# EAGLE design valve board-OSH (EAGLE 7.6.0)
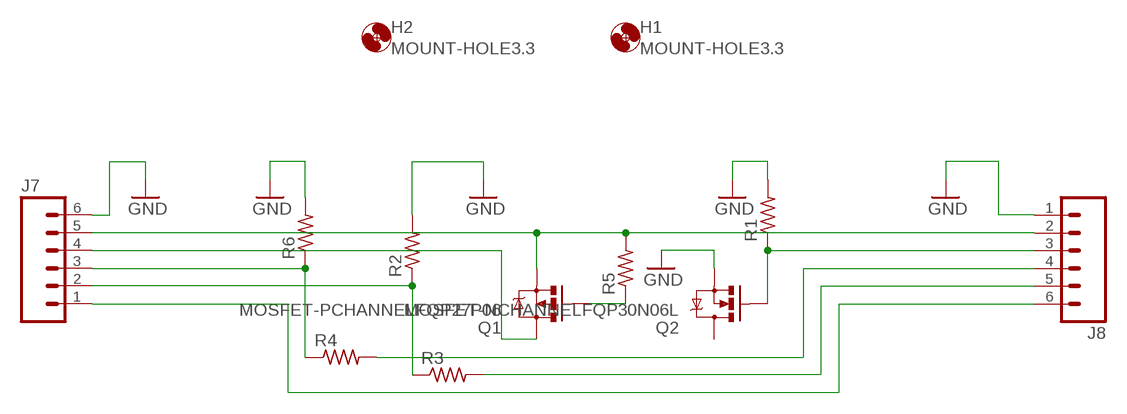
[diagram p0: schematic, sheet 1]

## Parts
H1  MOUNT-HOLE3.3  [3,3]
H2  MOUNT-HOLE3.3  [3,3]
J7  M06LOCK_LONGPADS  [1X06_LOCK_LONGPADS]
J8  M06LOCK_LONGPADS  [1X06_LOCK_LONGPADS]
Q1  MOSFET-PCHANNELFQP27P06  [TO220V]
Q2  MOSFET-NCHANNELFQP30N06L  [TO220V]
R1  R-US_0207/10  [0207/10]
R2  R-US_0207/10  [0207/10]
R3  R-US_0207/10  [0207/10]
R4  R-US_0207/10  [0207/10]
R5  R-US_0207/10  [0207/10]
R6  R-US_0207/10  [0207/10]

## Nets
GND: J7.6 J8.1 Q2.3(S) R1.2 R2.2 R6.2
N$1: J8.4 R4.2
N$2: J8.5 R3.2
N$3: J7.4 Q1.2(D)
N$4: J7.5 J8.2 Q1.3(S) R5.2
N$6: J7.2 R2.1 R3.1
N$7: Q1.1(G) R5.1
N$9: J8.3 Q2.1(G) R1.1
N$10: J7.3 R4.1 R6.1
N$12: J7.1 J8.6
Unconnected: Q2.2(D)

## Library data of the parts
H1 H2 = holes:MOUNT-HOLE: MOUNTING HOLE with drill center marker
J7 J8 = SparkFun-Connectors:M06: Header 6 Standard 6-pin 0.1" header. Use with straight break away headers (SKU : PRT-00116), right angle break away headers (PRT-00553), swiss pins (PRT-00743), machine pins (PRT-00117), and female headers (PRT-00115). Molex polarized connector foot print use with SKU : PRT-08094 with associated crimp pins and housings. NOTES ON THE VARIANTS LOCK and LOCK_LONGPADS... This footprint was designed to help hold the alignment of a through-hole component (i.e. 6-pin header) while soldering it into place. You may notice that each hole has been shifted either up or down by 0.005 of an inch from it's more standard position (which is a perfectly straight line). This slight alteration caused the pins (the squares in the middle) to touch the edges of the holes. Because they are alternating, it causes a "brace" to hold the component in place. 0.005 has proven to be the perfect amount of "off-center" position when using our standard breakaway headers. Although looks a little odd when you look at the bare footprint, once you have a header in there, the alteration is very hard to notice. Also,if you push a header all the way into place, it is covered up entirely on the bottom side. This idea of altering the position of holes to aid alignment will be further integrated into the Sparkfun Library for other footprints. It can help hold any component with 3 or more connection pins.
Q1 = SparkFun-DiscreteSemi:MOSFET-PCHANNEL: Generic PMOSFET IRLML2244 - TRANS-11153 (SOT-23 -20V -4.3A) (1.Gate 2.Source 3.Drain) FQP27P06 - COM-10349 <http://www.sparkfun.com/products/10349> (TO-220 -60V -27A) (1.Gate 2.Source 3.Drain)
Q2 = SparkFun-DiscreteSemi:MOSFET-NCHANNEL: Common NMOSFET Parts MFG P/N Store ID Prod ID FDD8780 TRANS-09984 SI7820DN TRANS-11055 FDS6630A IC-08089 2N7002PW TRANS-11151 FQP30N06L COM-10213 TRANS-10060 BSS123LT1G TRANS-08345 BSS138 TRANS-00830 BS170 2N7000; PROD_ID: TRANS-10060
R1-R6 = resistor:R-US_: RESISTOR, American symbol

## Board
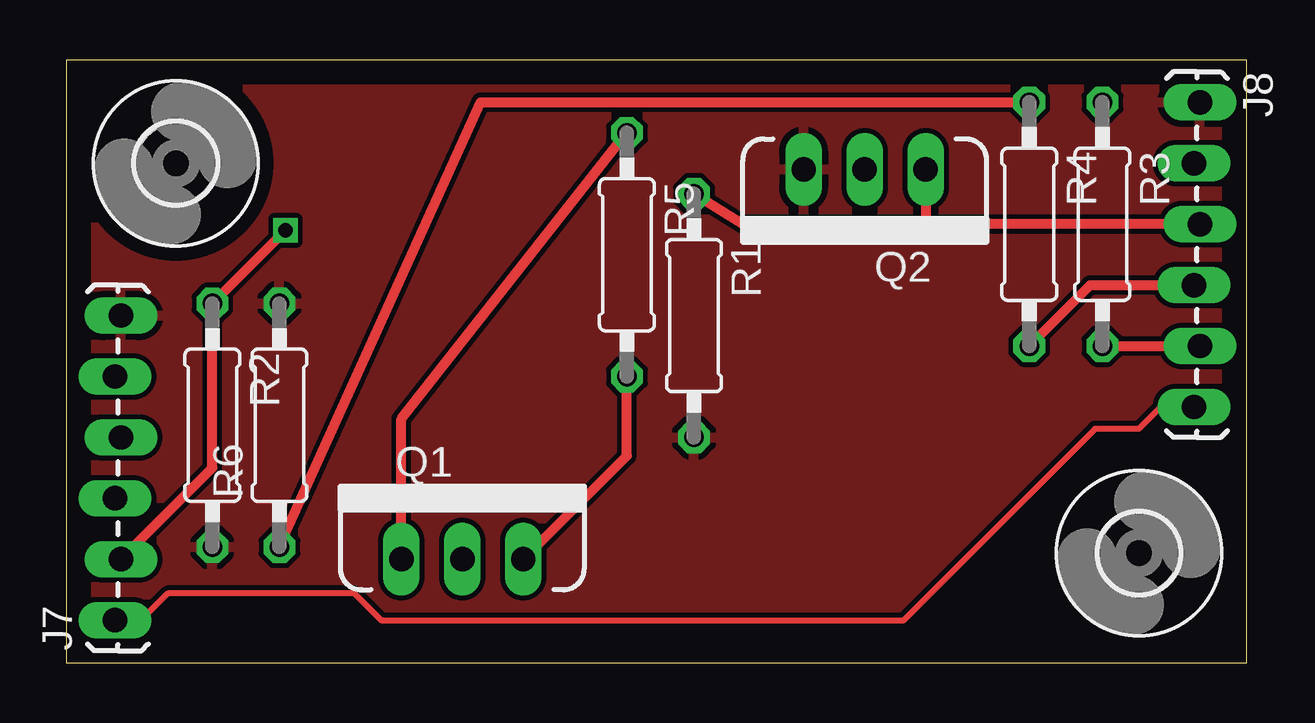
[diagram p1: board, top side]
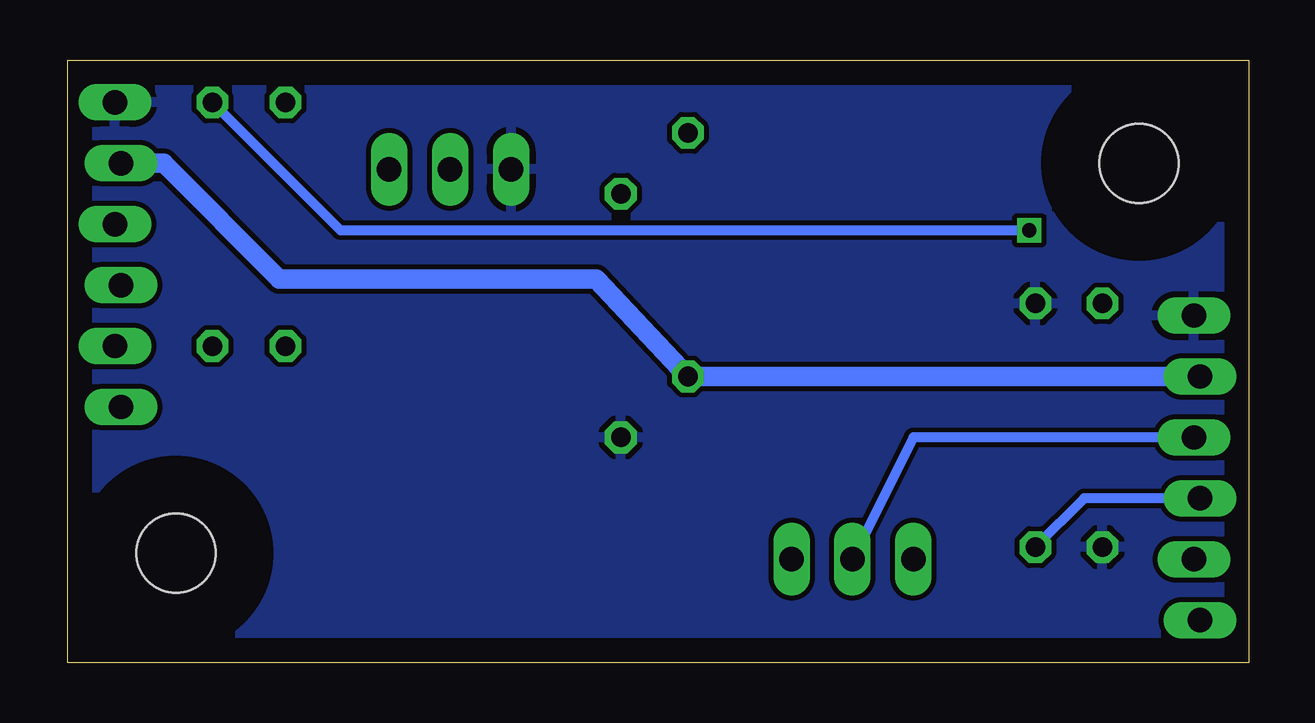
[diagram p2: board, bottom side, seen from below]

Size 49.2 x 25.14 mm. Coordinates in mm from the lower left corner, seen from the top.
Outline: 0,0 49.2,0 49.2,25.14 0,25.14 0,0
Copper layers (1*16): Top 0.035mm / dielectric 1.5mm / Bottom 0.035mm
Design rules "default": minimum track width 10mil, minimum drill 24mil, track to track 8mil, track to pad 8mil, pad to pad 8mil, via to via 8mil, smd to smd 8mil, copper to edge 40mil, drill to drill 8mil, minimum pad ring 10mil, minimum via ring 8mil, stop-mask expansion 4mil, vias tented up to drill 0mil, thermal gap 10mil

### Footprints (pad centres in the part's own frame; a part is rotated, then mirrored left to right if it is on the bottom)
3,3 = hole 3.3: 0,0
1X06_LOCK_LONGPADS = drill 1.016 long: 1 0,0; 2 2.54,-0.254; 3 5.08,0; 4 7.62,-0.254; 5 10.16,0; 6 12.7,-0.254
TO220V = drill 1.016 long: 1 -2.54,0; 2 0,0; 3 2.54,0
0207/10 = drill 0.813 octagon: 1 -5.08,0; 2 5.08,0

### Placement (x,y rotation side)
H1  4.57,20.83 0 top
H2  44.7,4.57 0 top
J7  2.03,1.78 90 top
J8  47.24,23.37 270 top
Q1  16.51,4.32 0 top
Q2  33.27,20.57 180 top
R1  26.16,14.48 270 top
R2  6.1,9.91 270 top
R3  43.18,18.29 270 top
R4  40.13,18.29 270 top
R5  23.37,17.02 270 top
R6  8.89,9.91 90 top

### Tracks (layer width: path | path; a pad name or v marks a point on that pad's centre or on a via)
GND
  pour Bottom: 0,25.15 49.28,25.15 49.28,0 0,0
  pour Top: 0,25.15 49.28,25.15 49.28,0 0,0
N$1
  Top 0.406: R4.2 42.67,15.75 J8.4
N$2
  Top 0.406: R3.2 J8.5
N$3
  Bottom 0.406: J7.4 13.97,9.4 Q1.2
N$4
  Top 0.406: Q1.3 23.37,8.64 R5.2
  Bottom 0.813: J7.5 R5.2 27.18,16 40.39,16 45.21,20.83 J8.2
N$6  (via drill 0.6)
  Top 0.406: J7.2 6.1,8.13 R2.1 v9.14,18.03
  Bottom 0.406: R3.1 37.85,18.03 v9.14,18.03
N$7
  Top 0.406: Q1.1 13.97,10.16 R5.1
N$9
  Top 0.406: J8.3 35.81,18.29 | Q2.1 35.81,18.29 | 35.81,18.29 28.19,18.29 R1.1
N$10
  Top 0.406: R6.1 17.27,23.37 R4.1
  Bottom 0.406: J7.3 6.86,6.86 R6.1
N$12
  Top 0.254: J8.6 45.62,10.67 44.7,9.75 42.88,9.75 34.87,1.75 13.16,1.75 12.01,2.9 4.24,2.9 3.33,1.98 2.18,1.98 J7.1